# Altium project SDA7123.PrjPcb
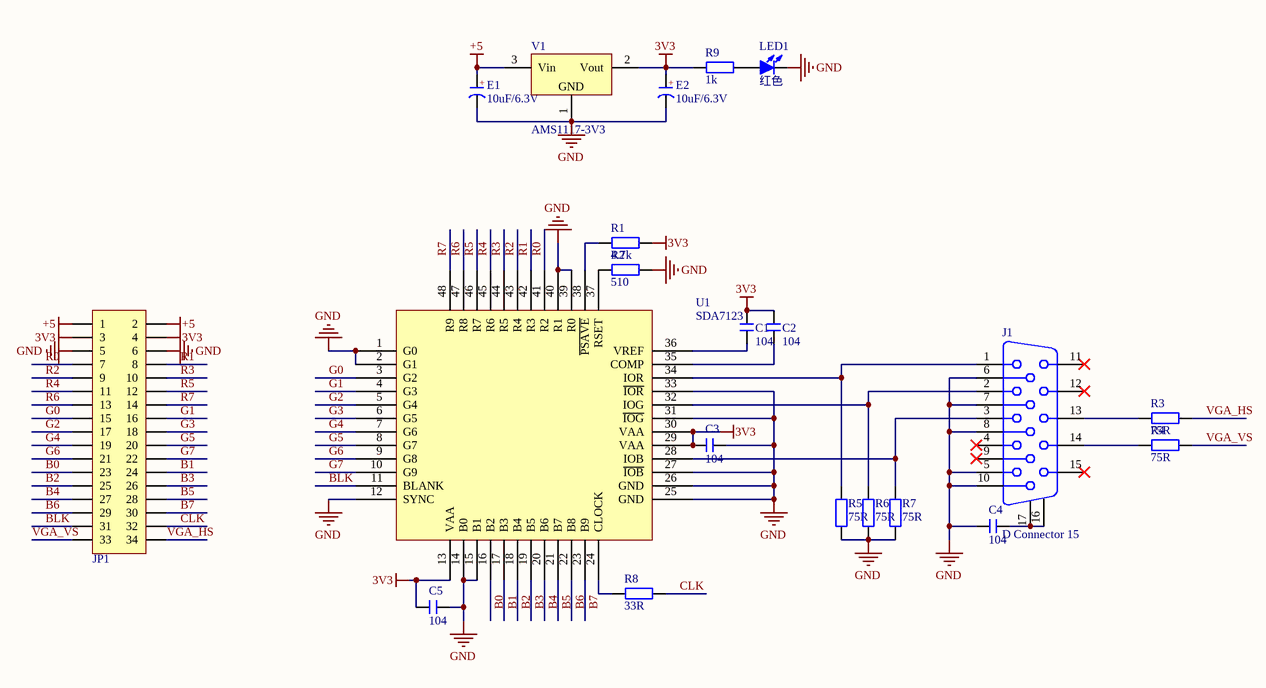
[diagram p0: SDA7123.SchDoc]
1 sheet, 21 parts. Net scope: global (net labels, ports and power ports of the same name join across sheets).
Board file: SDA7123.PcbDoc

## Sheet SDA7123.SchDoc
size A4

### Parts
C1  104  [C 0805_L]
C2  104  [C 0805_L]
C3  104  [C 0805_L]
C4  104  [C 0805_L]
C5  104  [C 0805_L]
E1  10uF/6.3V  [CD A(3216)]
E2  10uF/6.3V  [CD A(3216)]
J1  D Connector 15  [VGA15b]
JP1  Header 2X11  [HDR2.54-LI-2x17P]  (value not drawn)
LED1  红色  [LED 0805B]
R1  4.7k  [R 0805_L]
R2  510  [R 0805_L]
R3  75R  [R 0805_L]
R4  75R  [R 0805_L]
R5  75R  [R 0805_L]
R6  75R  [R 0805_L]
R7  75R  [R 0805_L]
R8  33R  [R 0805_L]
R9  1k  [R 0805_L]
U1  SDA7123  [LQFP48 7X7_N]
V1  AMS1117-3V3  [SOT223_L]

### Nets
3V3: C1.2 C2.2 C3.2 C5.1 E2.1(A) JP1.3 JP1.4 R1.2 R9.1 U1.13(VAA) U1.29(VAA) U1.30(VAA) V1.2(Vout)
+5: E1.1(A) JP1.1 JP1.2 V1.3(Vin)
GND: C3.1 C4.2 C5.2 E1.2(K) E2.2(K) J1.5 J1.6 J1.7 J1.8 J1.10 JP1.5 JP1.6 LED1.2(K) R2.2 R5.1 R6.1 R7.1 U1.1(G0) U1.2(G1) U1.12(SYNC) U1.14(B0) U1.15(B1) U1.25(GND) U1.26(GND) U1.27(~{IOB}) U1.31(~{IOG}) U1.33(~{IOR}) U1.39(R0) U1.40(R1) V1.1(GND)
B0: JP1.23 U1.16(B2)
B1: JP1.24 U1.17(B3)
B2: JP1.25 U1.18(B4)
B3: JP1.26 U1.19(B5)
B4: JP1.27 U1.20(B6)
B5: JP1.28 U1.21(B7)
B6: JP1.29 U1.22(B8)
B7: JP1.30 U1.23(B9)
BLK: JP1.31 U1.11(BLANK)
CLK: JP1.32 R8.2
G0: JP1.15 U1.3(G2)
G1: JP1.16 U1.4(G3)
G2: JP1.17 U1.5(G4)
G3: JP1.18 U1.6(G5)
G4: JP1.19 U1.7(G6)
G5: JP1.20 U1.8(G7)
G6: JP1.21 U1.9(G8)
G7: JP1.22 U1.10(G9)
R0: JP1.7 U1.41(R2)
R1: JP1.8 U1.42(R3)
R2: JP1.9 U1.43(R4)
R3: JP1.10 U1.44(R5)
R4: JP1.11 U1.45(R6)
R5: JP1.12 U1.46(R7)
R6: JP1.13 U1.47(R8)
R7: JP1.14 U1.48(R9)
VGA_HS: JP1.34 R3.1
VGA_VS: JP1.33 R4.1
NetC1_1: C1.1 U1.36(VREF)
NetC2_1: C2.1 U1.35(COMP)
NetC4_1: C4.1 J1.16(MH2) J1.17(MH1)
NetJ1_1: J1.1 R5.2 U1.34(IOR)
NetJ1_2: J1.2 R6.2 U1.32(IOG)
NetJ1_3: J1.3 R7.2 U1.28(IOB)
NetJ1_13: J1.13 R3.2
NetJ1_14: J1.14 R4.2
NetLED1_1: LED1.1(A) R9.2
NetR1_1: R1.1 U1.38(~{PSAVE})
NetR2_1: R2.1 U1.37(RSET)
NetR8_1: R8.1 U1.24(CLOCK)

Not connected (* = marked no-connect by the designer): J1 4* 9* 11* 12* 15*

### Notes on the sheet
- (in symbol CT) +

### Library data of the parts
C1-C5 = C: 贴片电容; BOM名称: 无极性贴片电容; 淘宝ID: 封装库来自淘宝 ID：黄晶宝石; 联系售后: https://shop463601444.taobao.com
E1 E2 = CT: 贴片钽电容; 淘宝ID: 封装库来自淘宝 ID：黄晶宝石; BOM名称: 贴片钽电容; 联系售后: https://shop463601444.taobao.com
J1 = D Connector 15: VGA通讯端口; 版权归属: 封装库来自淘宝 ID：黄晶宝石; 学习资源: https://shop463601444.taobao.com; BOM名称: VGA通讯端口
JP1 = Header 17X2: 17*2P接插件; 版权归属: 封装库来自淘宝 ID：黄晶宝石; BOM名称: 17*2P接插件; 学习资源: https://shop463601444.taobao.com
LED1 = LED-SMD: 贴片LED; 版权归属: 封装库来自淘宝 ID：黄晶宝石; BOM名称: 贴片LED; 学习资源: https://shop463601444.taobao.com
R1-R9 = R: 贴片电阻; 版权归属: 来自淘宝 ID：黄晶宝石; BOM名称: 贴片电阻; 联系售后: https://shop463601444.taobao.com
V1 = AMS1117: 三端稳压芯片; BOM名称: 稳压芯片; 淘宝ID: 封装库来自淘宝 ID：黄晶宝石; 欢迎光临淘宝店铺: https://shop463601444.taobao.com